# Altium project PICC-sinSMA.PrjPCB
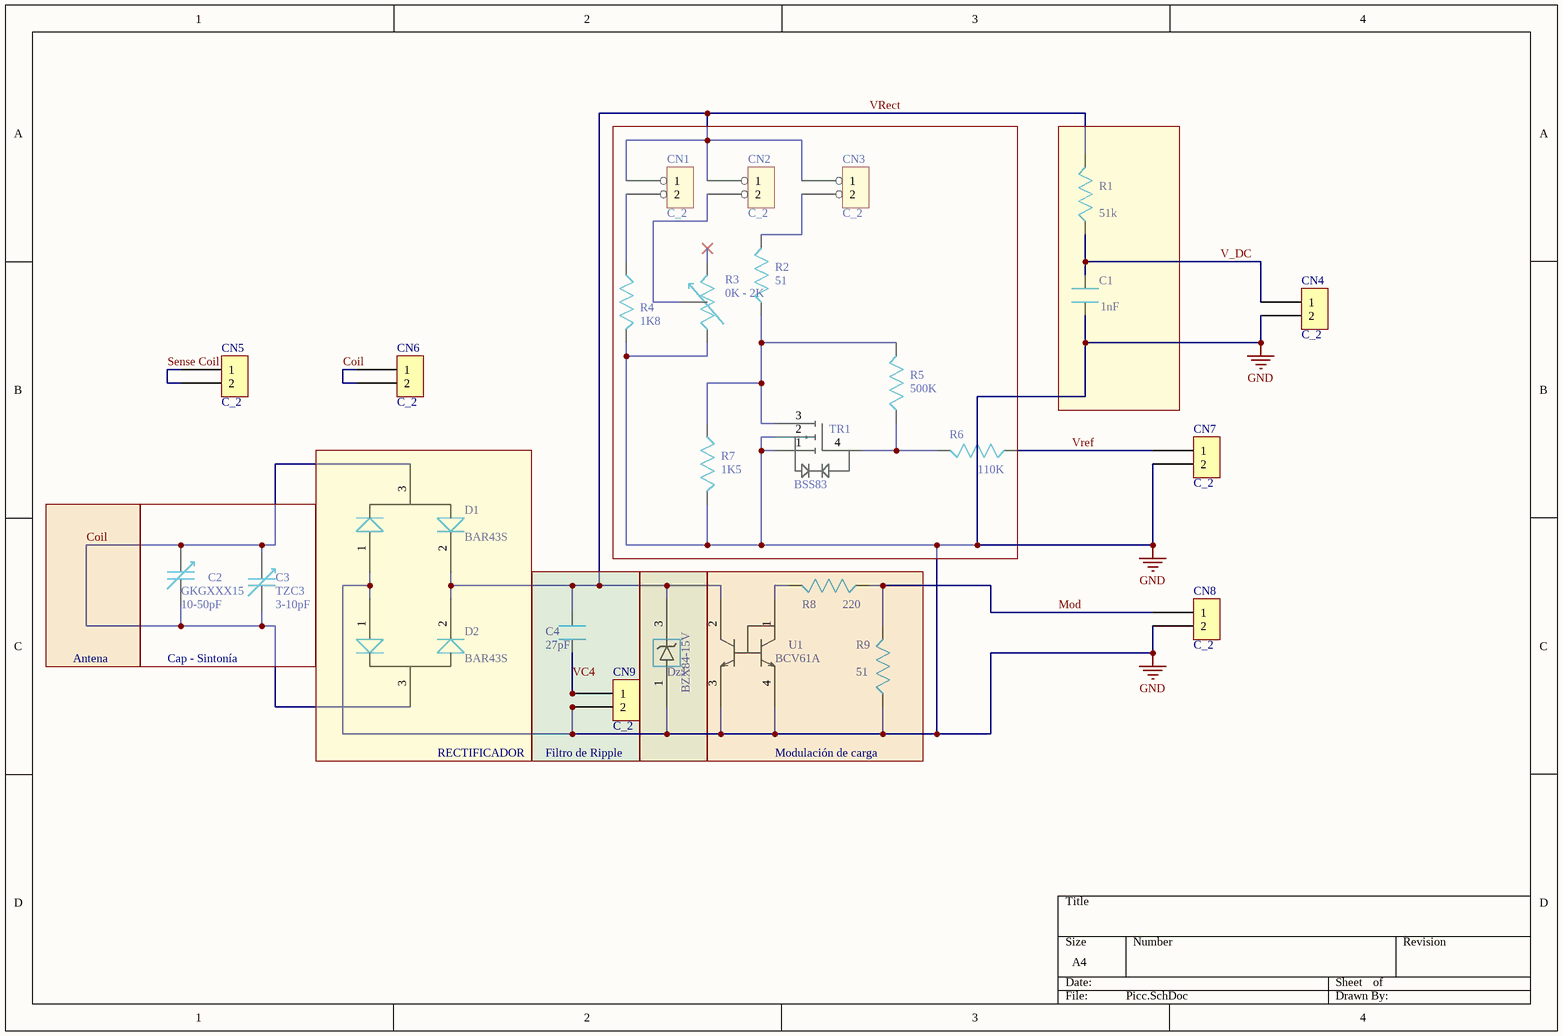
[diagram p0: Picc.SchDoc]
2 sheets, 38 parts. Net scope: global (net labels, ports and power ports of the same name join across sheets).
Board file: PCB1.PcbDoc
Sheets:
  Picc.SchDoc
  DemDis.SchDoc

## Sheet Picc.SchDoc
size A4

### Parts
C1  1nF  [C_1210]
C2  GKGXXX15  [GKGXXX15]
C3  TZC3  [TZC3]
C4  27pF  [C_1210]
CN1  C_2  [2x1 Pin Array]
CN2  C_2  [2x1 Pin Array]
CN3  C_2  [2x1 Pin Array]
CN4  C_2  [2x1 Pin Array]
CN5  C_2  [2x1 Pin Array]  (net tie, no BOM)
CN6  C_2  [2x1 Pin Array]  (net tie, no BOM)
CN7  C_2  [2x1 Pin Array]
CN8  C_2  [2x1 Pin Array]
CN9  C_2  [2x1 Pin Array]
D1  BAR43S  [BAR43S]
D2  BAR43S  [BAR43S]
Dz1  BZX84-15V  [BZX84]
R1  51k  [R_1210]
R2  51  [R_1210]
R3  0K - 2K  [Bourns 3224W]
R4  1K8  [R_1210]
R5  500K  [R_1210]
R6  110K  [R_1210]
R7  1K5  [R_1210]
R8  220  [R_1210]
R9  51  [R_1210]
TR1  BSS83  [BSS83]
U1  BCV61A  [BCV61A]

### Blocks framed on the sheet
RECTIFICADOR: D1 D2
Cap - Sintonía: C2 C3
Filtro de Ripple: C4 CN9
Modulación de carga: R8 R9 U1

### Nets
GND: C1.1 CN4.2 CN7.2 CN8.2 CN9.2 D1.1 D2.1 Dz1.1 R3.1 R4.2 R7.2 R9.1 TR1.1(s) TR1.2(b) U1.3 U1.4
V_DC: C1.2 CN4.1 R1.1
Coil: C2.0 C2.1 C3.0 C3.1 CN6.1 CN6.2 D1.3 D2.3
Mod: CN8.1 R8.1 R9.2
Sense Coil: CN5.1 CN5.2
VC4: C4.1 CN9.1
VRect: C4.2 CN1.1 CN2.1 CN3.1 D1.2 D2.2 Dz1.3 R1.2 U1.2
Vref: CN7.1 R6.1
NetCN1_2: CN1.2 R4.1
NetCN2_2: CN2.2 R3.3
NetCN3_2: CN3.2 R2.2
NetR2_1: R2.1 R5.2 R7.1 TR1.3(d)
NetR5_1: R5.1 R6.2 TR1.4(g)
NetR8_2: R8.2 U1.1

Not connected (* = marked no-connect by the designer): R3 2*

### Notes on the sheet
- Antena
- (in symbol GKGXXX15) 10-50pF
- (in symbol TZC3) 3-10pF

### Library data of the parts
C1 C4 = Cap: Ceramic Capacitor
C2 = GKGXXX15: 10
CN1-CN9 = C_2: Conector 2 pines
Dz1 = BZX84
R1 R2 R4-R9 = R: Chip Resistor
R3 = Rvar: SMD Potentiometer

## Sheet DemDis.SchDoc
size A4
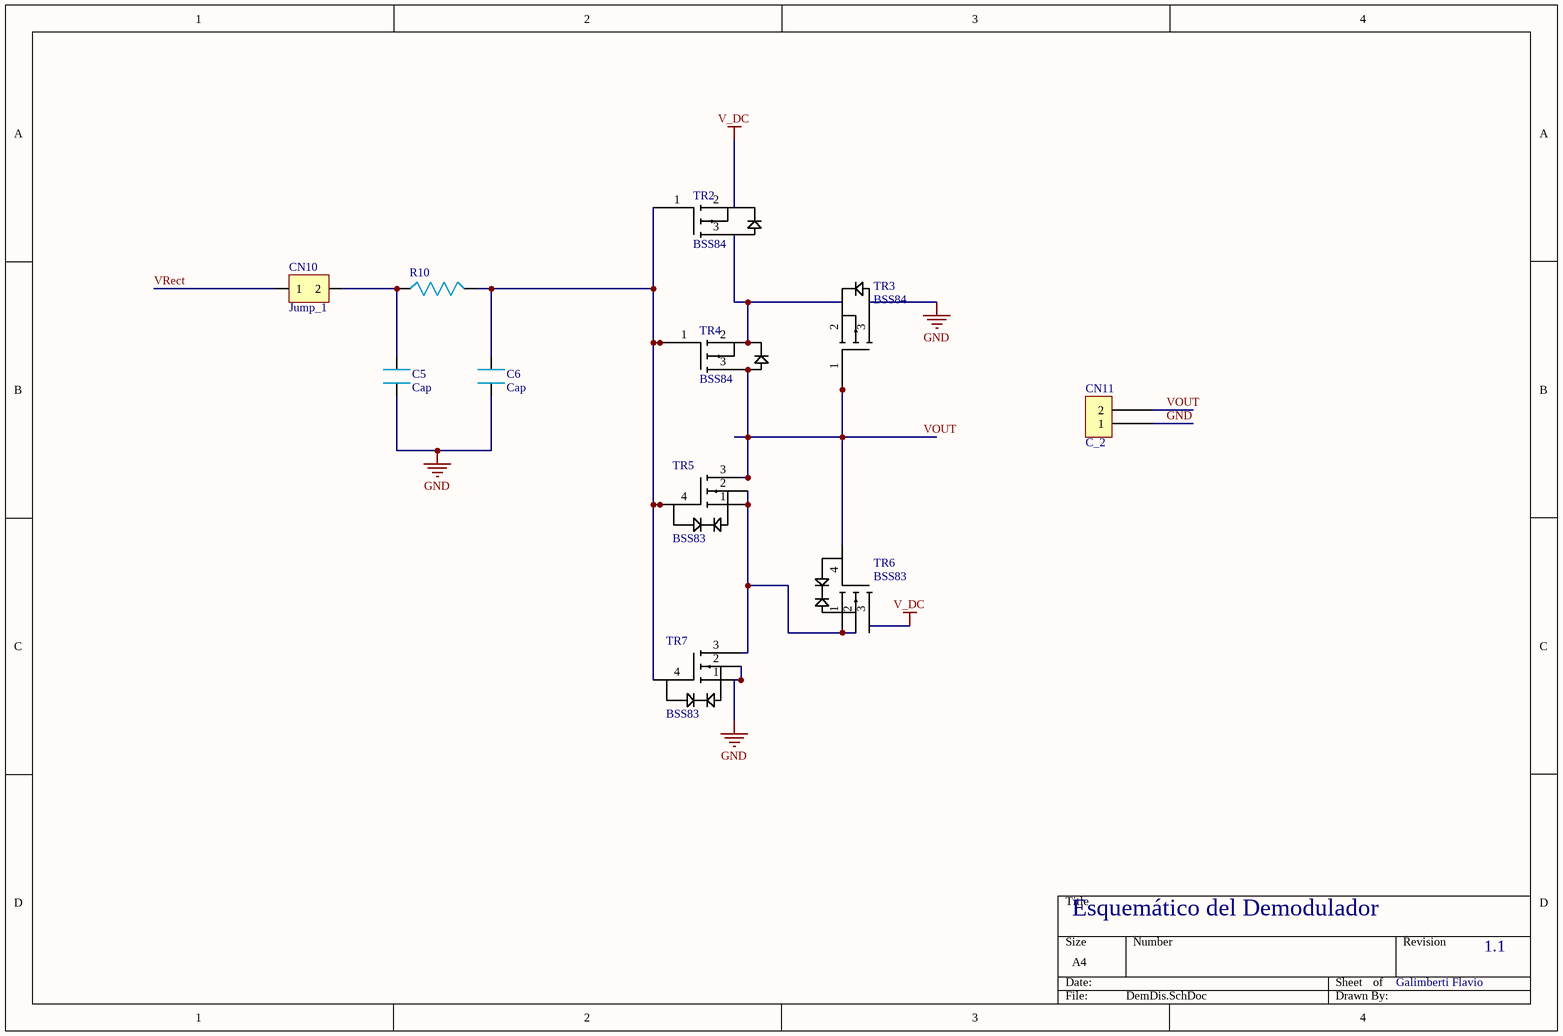
[diagram p1: DemDis.SchDoc]

### Parts
C5  Cap  [C_1210]
C6  Cap  [C_1210]
CN10  Jump_1  [2x1 Pin Array]
CN11  C_2  [2x1 Pin Array]
R10  R_1/4  [R_1210]  (value not drawn)
TR2  BSS84  [SOT_23]
TR3  BSS84  [SOT_23]
TR4  BSS84  [SOT_23]
TR5  BSS83  [BSS83]
TR6  BSS83  [BSS83]
TR7  BSS83  [BSS83]

### Nets
GND: C5.2 C6.2 CN11.1 TR3.3(d) TR7.1(s) TR7.2(b)
V_DC: TR2.2(s) TR6.3(d)
VOUT: CN11.2 TR3.1(g) TR4.3(d) TR5.3(d) TR6.4(g)
VRect: CN10.1
NetC5_1: C5.1 CN10.2 R10.1
NetC6_1: C6.1 R10.2 TR2.1(g) TR4.1(g) TR5.4(g) TR7.4(g)
NetTR2_3: TR2.3(d) TR3.2(s) TR4.2(s)
NetTR5_1: TR5.1(s) TR5.2(b) TR6.1(s) TR6.2(b) TR7.3(d)

### Notes on the sheet
- Esquemático del Demodulador
- Galimberti Flavio
- 1.1

### Library data of the parts
C5 C6 = Cap: Ceramic Capacitor
CN10 = Jump_1: Conector 2 pines
CN11 = C_2: Conector 2 pines
R10 = R_1/4: Chip Resistor

## Nets that join several sheets
GND: Picc (16 pins), DemDis (6 pins)
V_DC: Picc (C1.2 CN4.1 R1.1), DemDis (TR2.2 TR6.3)
VRect: Picc (9 pins), DemDis (CN10.1)